# Altium schematic sheet Main.SchDoc
size A4; SheetNumber: 3; SheetTotal: 4
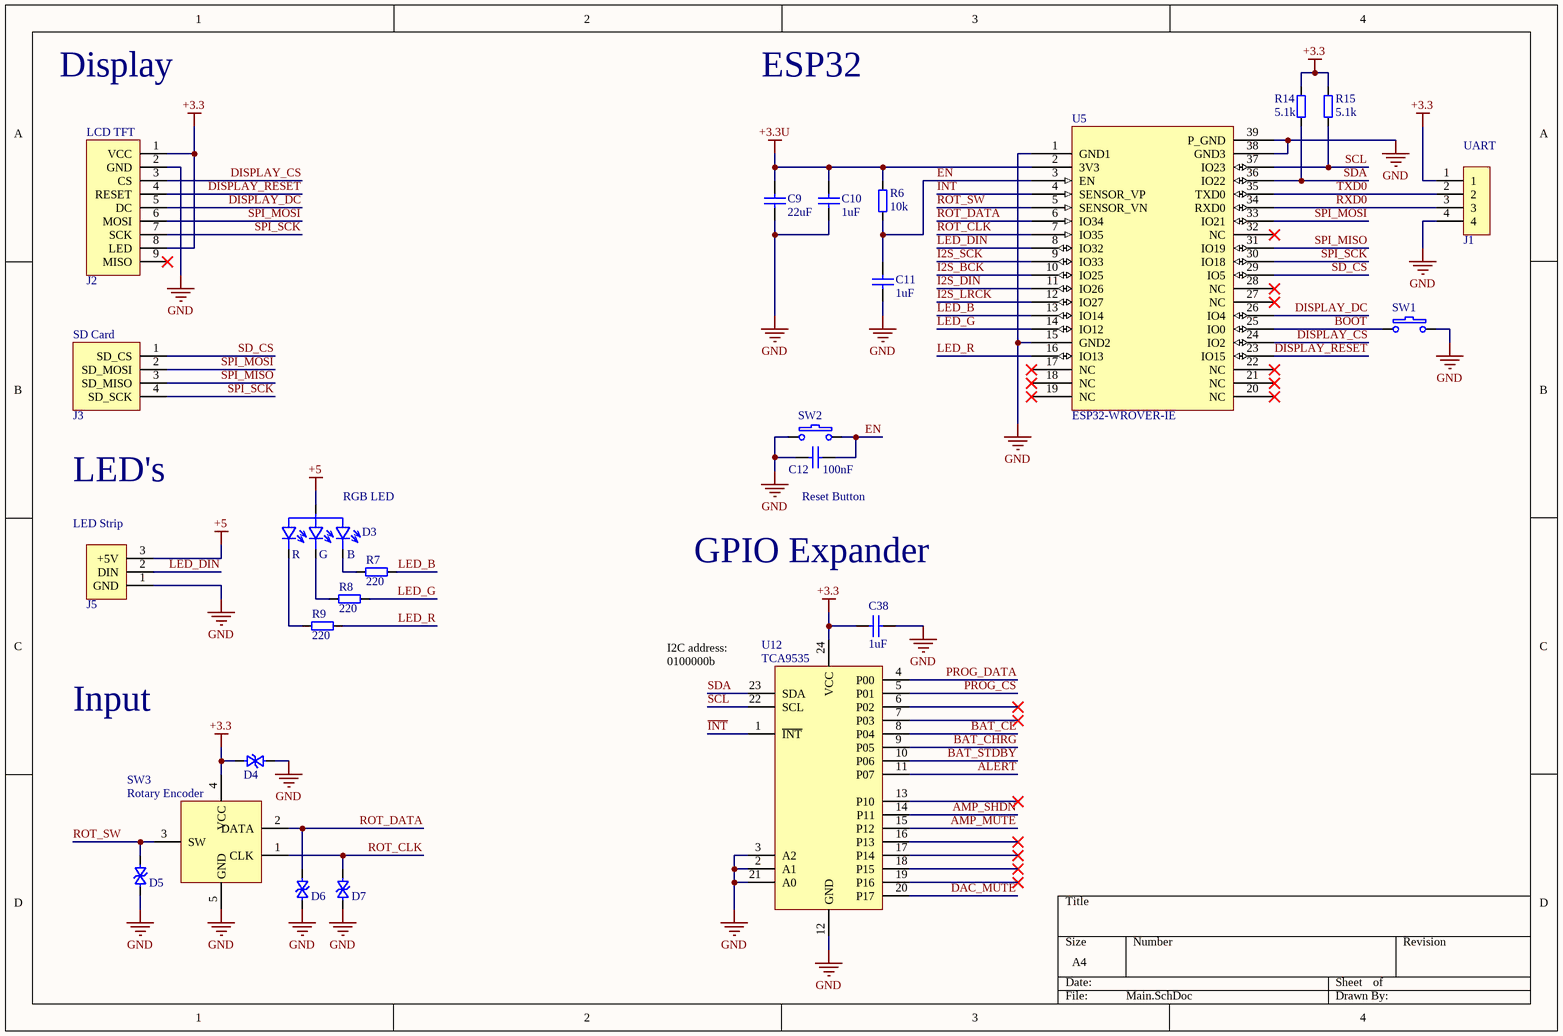
[diagram p0: Main.SchDoc]

## Parts
C9  Capacitance: 22uF  [CAP 0805]  (hidden comment: Capacitor_22uF)
C10  Capacitance: 1uF  [CAP 0805]  (hidden comment: Capacitor_1uF)
C11  Capacitance: 1uF  [CAP 0805]  (hidden comment: Capacitor_1uF)
C12  Capacitance: 100nF  [CAP 0805]  (hidden comment: Capacitor_100nF)
C38  Capacitance: 1uF  [CAP 0805]  (hidden comment: Capacitor_1uF)
D3  LED_RGB  [4Pin]  (value not drawn)
D4  Diode_TVS_Bi  [DIOM4226X24N]  (value not drawn)
D5  Diode_TVS_Bi  [DIOM4226X24N]  (value not drawn)
D6  Diode_TVS_Bi  [DIOM4226X24N]  (value not drawn)
D7  Diode_TVS_Bi  [DIOM4226X24N]  (value not drawn)
J1  1x4 Header  [1x4 Header]  (value not drawn)
J2  1x4 Header  [1X9 HEADER]  (value not drawn)
J3  1x4 Header  [1x4 Header]  (value not drawn)
J5  1x3_Header  [1x3Header]  (value not drawn)
R6  Resistance: 10k  [RES 0805]  (hidden comment: Resistor_10k)
R7  Resistance: 220  [RES 0805]  (hidden comment: Resistor_220)
R8  Resistance: 220  [RES 0805]  (hidden comment: Resistor_220)
R9  Resistance: 220  [RES 0805]  (hidden comment: Resistor_220)
R14  Resistance: 5.1k  [RES 0805]  (hidden comment: Resistor_5.1k)
R15  Resistance: 5.1k  [RES 0805]  (hidden comment: Resistor_5.1k)
SW1  Switch_PB  [2Pin]  (value not drawn)
SW2  Switch_PB  [2Pin]  (value not drawn)
SW3  Rotary Encoder  [1x5 Header]
U5  ESP32-WROVER-IE  [ESP32 WROVER]
U12  TCA9535  [TSOP65P640X120-24N]

## Nets
+3.3: C38.2 D4.1 J1.1 J2.1(VCC) J2.8(LED) R14.2 R15.2 SW3.4(VCC) U12.24(VCC)
+3.3U: C9.2 C10.2 R6.2 U5.2(3V3)
+5: D3.2(Anode) J5.3(+5V)
GND: C9.1 C10.1 C11.1 C12.1 C38.1 D4.2 D5.2 D6.2 D7.2 J1.4 J2.2(GND) J5.1(GND) SW1.2 SW2.1 SW3.5(GND) U5.1(GND1) U5.15(GND2) U5.38(GND3) U5.39(P_GND) U12.2(A1) U12.3(A2) U12.12(GND) U12.21(A0)
ALERT: U12.11(P07)
AMP_~{MUTE}: U12.15(P12)
AMP_~{SHDN}: U12.14(P11)
BAT_CE: U12.8(P04)
BAT_CHRG: U12.9(P05)
BAT_STDBY: U12.10(P06)
BOOT: SW1.1 U5.25(IO0)
DAC_MUTE: U12.20(P17)
DISPLAY_CS: J2.3(CS) U5.24(IO2)
DISPLAY_DC: J2.5(DC) U5.26(IO4)
DISPLAY_RESET: J2.4(RESET) U5.23(IO15)
EN: C11.2 C12.2 R6.1 SW2.2 U5.3(EN)
I2S_BCK: U5.10(IO25)
I2S_DIN: U5.11(IO26)
I2S_LRCK: U5.12(IO27)
I2S_SCK: U5.9(IO33)
~{INT}: U5.4(SENSOR_VP) U12.1(~{INT})
LED_B: R7.1 U5.13(IO14)
LED_DIN: J5.2(DIN) U5.8(IO32)
LED_G: R8.1 U5.14(IO12)
LED_R: R9.1 U5.16(IO13)
PROG_CS: U12.5(P01)
PROG_DATA: U12.4(P00)
ROT_CLK: D7.1 SW3.1(CLK) U5.7(IO35)
ROT_DATA: D6.1 SW3.2(DATA) U5.6(IO34)
ROT_SW: D5.1 SW3.3(SW) U5.5(SENSOR_VN)
RXD0: J1.3 U5.34(RXD0)
SCL: R15.1 U5.37(IO23) U12.22(SCL)
SD_CS: J3.1(SD_CS) U5.29(IO5)
SDA: R14.1 U5.36(IO22) U12.23(SDA)
SPI_MISO: J3.3(SD_MISO) U5.31(IO19)
SPI_MOSI: J2.6(MOSI) J3.2(SD_MOSI) U5.33(IO21)
SPI_SCK: J2.7(SCK) J3.4(SD_SCK) U5.30(IO18)
TXD0: J1.2 U5.35(TXD0)
NetD3_1: D3.1(Red) R9.2
NetD3_3: D3.3(Green) R8.2
NetD3_4: D3.4(Blue) R7.2

Not connected (* = marked no-connect by the designer): J2 9(MISO)*; U5 17(NC)* 18(NC)* 19(NC)* 20(NC)* 21(NC)* 22(NC)* 27(NC)* 28(NC)* 32(NC)*; U12 6(P02)* 7(P03)* 13(P10)* 16(P13)* 17(P14)* 18(P15)* 19(P16)*

## Notes on the sheet
- Display
- ESP32
- (near J2) LCD TFT
- (near J1) UART
- (near J3) SD Card
- LED's
- (near D3) RGB LED
- Reset Button
- (near J5) LED Strip
- GPIO Expander
- Input
- (near U12) I2C address:
  0100000b
- (in symbol LED_RGB) R; G; B

## Library data of the parts
J1 = 1x4_Header
J2 = 1x9_Header TFT Screen
J3 = 1x4_Header SD Card
J5 = 1x3_Header WS2812B
U12 = TCA9535: I2C GPIO Expander